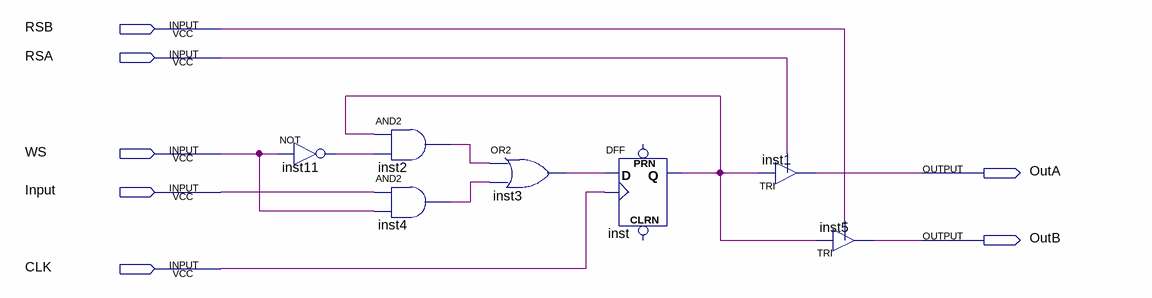
[diagram p0: schematic sheet]
// Quartus schematic reg_cell.bdf as structural Verilog: 7 symbols, 7 pins
module reg_cell (
  input  RSB,
  input  RSA,
  input  WS,
  input  Input,
  input  CLK,
  output OutA,
  output OutB
);

  wire inst2_out, inst3_out, inst4_out, inst11_out, inst_q;

  not inst11 (inst11_out, WS);
  and inst2 (inst2_out, inst_q, inst11_out);
  and inst4 (inst4_out, Input, WS);
  or inst3 (inst3_out, inst2_out, inst4_out);
  DFF inst (.CLK(CLK), .D(inst3_out), .Q(inst_q));  // open: CLRN, PRN
  TRI inst1 (.IN(inst_q), .OE(RSA), .OUT(OutA));
  TRI inst5 (.IN(inst_q), .OE(RSB), .OUT(OutB));
endmodule
